# Altium project TLO Rock electronics.PrjPcb
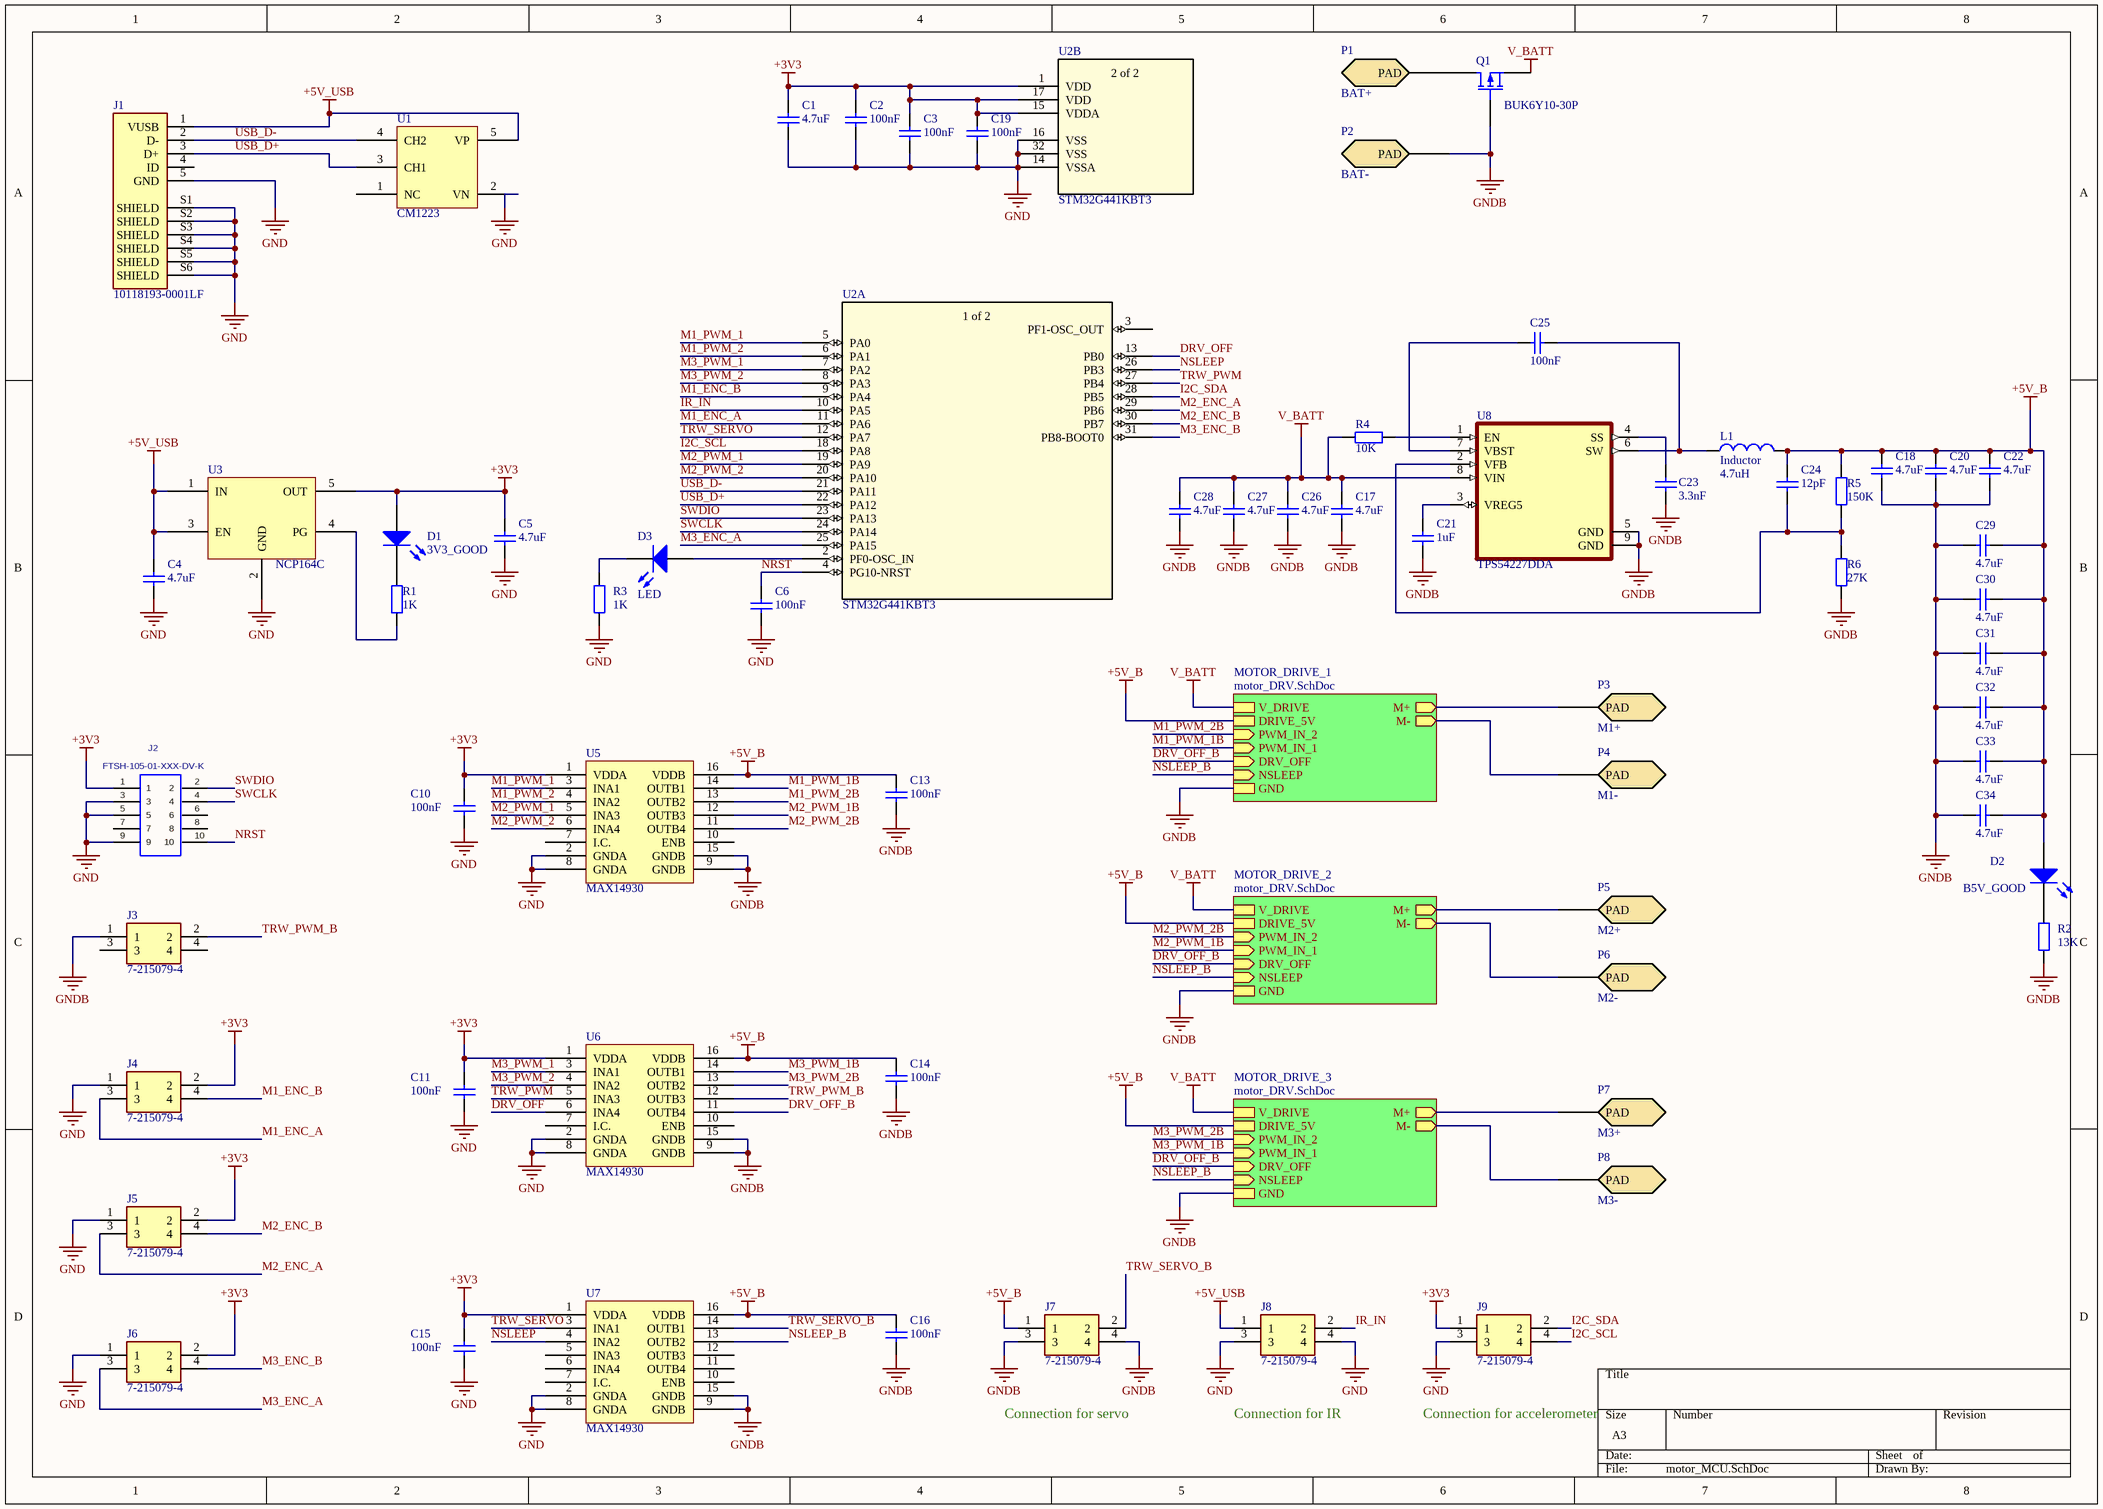
[diagram p0: motor_MCU.SchDoc]
2 sheets, 101 parts. Net scope: hierarchical (ports join the sheet entries above them; power ports are global).
Board file: PCB.PcbDoc
Sheets:
  motor_MCU.SchDoc
    MOTOR_DRIVE_1 = motor_DRV.SchDoc
    MOTOR_DRIVE_2 = motor_DRV.SchDoc
    MOTOR_DRIVE_3 = motor_DRV.SchDoc

## Sheet motor_MCU.SchDoc
size A3; SheetNumber: 1; SheetTotal: 2

### Parts
C1  value 4.7uF  [1608[0603]]  (hidden comment: Cap Semi)
C2  value 100nF  [1608[0603]]  (hidden comment: Cap Semi)
C3  value 100nF  [1608[0603]]  (hidden comment: Cap Semi)
C4  value 4.7uF  [1608[0603]]  (hidden comment: Cap Semi)
C5  value 4.7uF  [1608[0603]]  (hidden comment: Cap Semi)
C6  value 100nF  [1608[0603]]  (hidden comment: Cap Semi)
C10  value 100nF  [1608[0603]]  (hidden comment: Cap Semi)
C11  value 100nF  [1608[0603]]  (hidden comment: Cap Semi)
C13  value 100nF  [1608[0603]]  (hidden comment: Cap Semi)
C14  value 100nF  [1608[0603]]  (hidden comment: Cap Semi)
C15  value 100nF  [1608[0603]]  (hidden comment: Cap Semi)
C16  value 100nF  [1608[0603]]  (hidden comment: Cap Semi)
C17  value 4.7uF  [1608[0603]]  (hidden comment: Cap Semi)
C18  value 4.7uF  [1608[0603]]  (hidden comment: Cap Semi)
C19  value 100nF  [1608[0603]]  (hidden comment: Cap Semi)
C20  value 4.7uF  [1608[0603]]  (hidden comment: Cap Semi)
C21  value 1uF  [1608[0603]]  (hidden comment: Cap Semi)
C22  value 4.7uF  [1608[0603]]  (hidden comment: Cap Semi)
C23  value 3.3nF  [1608[0603]]  (hidden comment: Cap Semi)
C24  value 12pF  [1608[0603]]  (hidden comment: Cap Semi)
C25  value 100nF  [1608[0603]]  (hidden comment: Cap Semi)
C26  value 4.7uF  [1608[0603]]  (hidden comment: Cap Semi)
C27  value 4.7uF  [1608[0603]]  (hidden comment: Cap Semi)
C28  value 4.7uF  [1608[0603]]  (hidden comment: Cap Semi)
C29  value 4.7uF  [1608[0603]]  (hidden comment: Cap Semi)
C30  value 4.7uF  [1608[0603]]  (hidden comment: Cap Semi)
C31  value 4.7uF  [1608[0603]]  (hidden comment: Cap Semi)
C32  value 4.7uF  [1608[0603]]  (hidden comment: Cap Semi)
C33  value 4.7uF  [1608[0603]]  (hidden comment: Cap Semi)
C34  value 4.7uF  [1608[0603]]  (hidden comment: Cap Semi)
D1  3V3_GOOD  [1608[0603]]
D2  B5V_GOOD  [1608[0603]]
D3  LED  [1608[0603]]
J1  10118193-0001LF  [FCI_10118193-0001LF]
J2  FTSH-105-01-XXX-DV-K  [FTSH-105-01-XXX-DV-K]
J3  7-215079-4  [TE_7-215079-4]
J4  7-215079-4  [TE_7-215079-4]
J5  7-215079-4  [TE_7-215079-4]
J6  7-215079-4  [TE_7-215079-4]
J7  7-215079-4  [TE_7-215079-4]
J8  7-215079-4  [TE_7-215079-4]
J9  7-215079-4  [TE_7-215079-4]
L1  Inductor  value 4.7uH  [WE-PD-M-PB]
P1  BAT+  [PCBComponent_1]
P2  BAT-  [PCBComponent_1]
P3  M1+  [PCBComponent_1]
P4  M1-  [PCBComponent_1]
P5  M2+  [PCBComponent_1]
P6  M2-  [PCBComponent_1]
P7  M3+  [PCBComponent_1]
P8  M3-  [PCBComponent_1]
Q1  BUK6Y10-30P  [TO127P600X120-5N]
R1  value 1K  [J1-0603]  (hidden comment: Res2)
R2  value 13K  [J1-0603]  (hidden comment: Res2)
R3  value 1K  [J1-0603]  (hidden comment: Res2)
R4  value 10K  [J1-0603]  (hidden comment: Res2)
R5  value 150K  [J1-0603]  (hidden comment: Res2)
R6  value 27K  [J1-0603]  (hidden comment: Res2)
U1  CM1223  [SOT23-5]
U2  STM32G441KBT3  [LQFP32_7X7_STM]  (parts A,B of 2)
U3  NCP164C  [SOT23-5]
U5  MAX14930  [SOIC16_N]
U6  MAX14930  [SOIC16_N]
U7  MAX14930  [SOIC16_N]
U8  TPS54227DDA  [VREG_LM5017MR/NOPB]

### Sub-sheets
MOTOR_DRIVE_1 = motor_DRV.SchDoc: V_DRIVE, DRIVE_5V, PWM_IN_2 (in), PWM_IN_1 (in), DRV_OFF (in), GND, M+ (out), M- (out), NSLEEP (in)
MOTOR_DRIVE_2 = motor_DRV.SchDoc: V_DRIVE, DRIVE_5V, PWM_IN_2 (in), PWM_IN_1 (in), DRV_OFF (in), GND, M+ (out), M- (out), NSLEEP (in)
MOTOR_DRIVE_3 = motor_DRV.SchDoc: V_DRIVE, DRIVE_5V, PWM_IN_2 (in), PWM_IN_1 (in), DRV_OFF (in), GND, M+ (out), M- (out), NSLEEP (in)

### Nets
+3V3: C1.2 C2.2 C3.2 C5.2 C10.2 C11.2 C15.2 C19.2 D1.1(A) J2.1 J4.2 J5.2 J6.2 J9.1 U2.1(VDD) U2.15(VDDA) U2.17(VDD) U3.5(OUT) U5.1(VDDA) U6.1(VDDA) U7.1(VDDA)
+5V_B: C13.2 C14.2 C16.2 C18.2 C20.2 C22.2 C24.2 C29.1 C30.1 C31.1 C32.1 C33.1 C34.1 D2.1(A) J7.1 L1.2 R5.1 U5.16(VDDB) U6.16(VDDB) U7.16(VDDB) ; sheet MOTOR_DRIVE_1/DRIVE_5V, sheet MOTOR_DRIVE_2/DRIVE_5V, sheet MOTOR_DRIVE_3/DRIVE_5V
+5V_USB: C4.2 J1.1(VUSB) J8.1 U1.5(VP) U3.1(IN) U3.3(EN)
GND: C1.1 C2.1 C3.1 C4.1 C5.1 C6.1 C10.1 C11.1 C15.1 C19.1 J1.5(GND) J1.S1(SHIELD) J1.S2(SHIELD) J1.S3(SHIELD) J1.S4(SHIELD) J1.S5(SHIELD) J1.S6(SHIELD) J2.3 J2.5 J2.9 J4.1 J5.1 J6.1 J8.3 J8.4 J9.3 R3.1 U1.2(VN) U2.14(VSSA) U2.16(VSS) U2.32(VSS) U3.2(GND) U5.2(GNDA) U5.8(GNDA) U6.2(GNDA) U6.8(GNDA) U7.2(GNDA) U7.8(GNDA)
GNDB: C13.1 C14.1 C16.1 C17.1 C18.1 C20.1 C21.1 C22.1 C23.2 C26.1 C27.1 C28.1 C29.2 C30.2 C31.2 C32.2 C33.2 C34.2 J3.1 J7.3 J7.4 P2.1(PAD) Q1.4(G) R2.1 R6.2 U5.9(GNDB) U5.15(GNDB) U6.9(GNDB) U6.15(GNDB) U7.9(GNDB) U7.15(GNDB) U8.5(GND) U8.9(GND) ; sheet MOTOR_DRIVE_1/GND, sheet MOTOR_DRIVE_2/GND, sheet MOTOR_DRIVE_3/GND
V_BATT: C17.2 C26.2 C27.2 C28.2 Q1.1,2,3(S) R4.2 U8.8(VIN) ; sheet MOTOR_DRIVE_1/V_DRIVE, sheet MOTOR_DRIVE_2/V_DRIVE, sheet MOTOR_DRIVE_3/V_DRIVE
DRV_OFF: U2.13(PB0) U6.6(INA4)
DRV_OFF_B: U6.11(OUTB4) ; sheet MOTOR_DRIVE_1/DRV_OFF, sheet MOTOR_DRIVE_2/DRV_OFF, sheet MOTOR_DRIVE_3/DRV_OFF  [project net DRV_OFF]
I2C_SCL: J9.4 U2.18(PA8)
I2C_SDA: J9.2 U2.28(PB5)
IR_IN: J8.2 U2.10(PA5)
M1_ENC_A: J4.3 U2.11(PA6)
M1_ENC_B: J4.4 U2.9(PA4)
M1_PWM_1: U2.5(PA0) U5.3(INA1)
M1_PWM_1B: U5.14(OUTB1) ; sheet MOTOR_DRIVE_1/PWM_IN_1
M1_PWM_2: U2.6(PA1) U5.4(INA2)
M1_PWM_2B: U5.13(OUTB2) ; sheet MOTOR_DRIVE_1/PWM_IN_2
M2_ENC_A: J5.3 U2.29(PB6)
M2_ENC_B: J5.4 U2.30(PB7)
M2_PWM_1: U2.19(PA9) U5.5(INA3)
M2_PWM_1B: U5.12(OUTB3) ; sheet MOTOR_DRIVE_2/PWM_IN_1
M2_PWM_2: U2.20(PA10) U5.6(INA4)
M2_PWM_2B: U5.11(OUTB4) ; sheet MOTOR_DRIVE_2/PWM_IN_2
M3_ENC_A: J6.3 U2.25(PA15)
M3_ENC_B: J6.4 U2.31(PB8-BOOT0)
M3_PWM_1: U2.7(PA2) U6.3(INA1)
M3_PWM_1B: U6.14(OUTB1) ; sheet MOTOR_DRIVE_3/PWM_IN_1
M3_PWM_2: U2.8(PA3) U6.4(INA2)
M3_PWM_2B: U6.13(OUTB2) ; sheet MOTOR_DRIVE_3/PWM_IN_2
M_OUT_+: P3.1(PAD) ; sheet MOTOR_DRIVE_1/M+
M_OUT_+: P5.1(PAD) ; sheet MOTOR_DRIVE_2/M+  [a separate net that carries the same name]
M_OUT_+: P7.1(PAD) ; sheet MOTOR_DRIVE_3/M+  [a separate net that carries the same name]
M_OUT_-: P4.1(PAD) ; sheet MOTOR_DRIVE_1/M-
M_OUT_-: P6.1(PAD) ; sheet MOTOR_DRIVE_2/M-  [a separate net that carries the same name]
M_OUT_-: P8.1(PAD) ; sheet MOTOR_DRIVE_3/M-  [a separate net that carries the same name]
NRST: C6.2 J2.10 U2.4(PG10-NRST)
NSLEEP: U2.26(PB3) U7.4(INA2)
NSLEEP_B: U7.13(OUTB2) ; sheet MOTOR_DRIVE_1/NSLEEP, sheet MOTOR_DRIVE_2/NSLEEP, sheet MOTOR_DRIVE_3/NSLEEP  [project net nSLEEP]
SWCLK: J2.4 U2.24(PA14)
SWDIO: J2.2 U2.23(PA13)
TRW_PWM: U2.27(PB4) U6.5(INA3)
TRW_PWM_B: J3.2 U6.12(OUTB3)
TRW_SERVO: U2.12(PA7) U7.3(INA1)
TRW_SERVO_B: J7.2 U7.14(OUTB1)
USB_D+: J1.3(D+) U1.3(CH1) U2.22(PA12)
USB_D-: J1.2(D-) U1.4(CH2) U2.21(PA11)
NetC21_2: C21.2 U8.3(VREG5)
NetC23_1: C23.1 U8.4(SS)
NetC24_1: C24.1 R5.2 R6.1 U8.2(VFB)
NetC25_1: C25.1 L1.1 U8.6(SW)
NetC25_2: C25.2 U8.7(VBST)
NetD1_2: D1.2(K) R1.2
NetD2_2: D2.2(K) R2.2
NetD3_1: D3.1(A) U2.2(PF0-OSC_IN)
NetD3_2: D3.2(K) R3.2
NetP1_1: P1.1(PAD) Q1.5(D)
NetR1_1: R1.1 U3.4(PG)
NetR4_1: R4.1 U8.1(EN)

Not connected (* = marked no-connect by the designer): J1 4(ID); J2 6 7 8; J3 3 4; U1 1(NC); U2 3(PF1-OSC_OUT); U5 7(I.C.) 10(ENB); U6 7(I.C.) 10(ENB); U7 5(INA3) 6(INA4) 7(I.C.) 10(ENB) 11(OUTB4) 12(OUTB3)

### Notes on the sheet
- Connection for servo
- Connection for IR
- Connection for accelerometer
- (in symbol STM32G441KBT3, part A) 1 of 2
- (in symbol STM32G441KBT3, part B) 2 of 2

### Library data of the parts
C1-C6 C10 C11 C13-C34 = Cap Semi: Capacitor (Semiconductor SIM Model); Published: 8-Jun-2000; LatestRevisionDate: 29-May-2009; LatestRevisionNote: IPC-7351 Footprint Added.; PackageReference: C1206; Publisher: Altium Limited; PackageDescription: Chip Capacitor
D1-D3 = LED2: Typical RED, GREEN, YELLOW, AMBER GaAs LED; Published: 8-Jun-2000; LatestRevisionDate: 17-Jul-2002; LatestRevisionNote: Re-released for DXP Platform.; PackageVersion: Feb-2002; PackageReference: 3.2X1.6X1.1; Publisher: Altium Limited; PackageDescription: SM LED; 2 Flat Leads
J1 = 10118193-0001LF: USB - micro B USB 2.0 Receptacle Connector 5 Position Surface Mount, Right Angle; Through Hole; MF: Amphenol ICC; Availability: Unavailable; SnapEDA_Link: https://www.snapeda.com/parts/10118193-0001LF/Amphenol%20FCI/view-part/2758989/?ref=snap; MP: 10118193-0001LF; Price: None; Value: *; Package: None
J2 = FTSH-105-01-XXX-DV-K: TERMINAL STRIP, .050"(1.27mm) PITCH, 10 PINS, KEYED; MANUFACTURER: SAMTEC; CREATED: November 30, 2016 - Wendy Xin; PCB DECAL: FTSH-105-01-XXX-DV-K
J3-J9 = 7-215079-4: Micro-MaTch 4 Position 1.27 mm Pitch Vertical Female-on-Board Connector; MF: TE Connectivity; MP: 7-215079-4; Value: *; SnapEDA_Link: https://www.snapeda.com/parts/7-215079-4/TE%20Connectivity%20AMP%20Connectors/view-part/453401/?ref=snap; Price: None; Package: SMD-6; Availability: Unavailable
L1 = Inductor: Code_IEC: 1005; Published: 8-Jun-2000; LatestRevisionDate: 29-May-2009; LatestRevisionNote: IPC-7351 Footprint Added.; PackageReference: 0402-A; Publisher: Altium Limited; PackageDescription: Chip Inductor; Code_JEITA: 0402
P1-P8 = Component_1
Q1 = MOSFET-P: P-Channel MOSFET; Published: 8-Jun-2000; LatestRevisionDate: 17-Jul-2002; LatestRevisionNote: Re-released for DXP Platform.; PackageVersion: 1995/1996; PackageReference: E3; Publisher: Altium Limited; PackageDescription: TO, Flat Index; 3 In-Line, Axial Leads; Body Dia. 4.6mm; Lead Dia. 0.5 mm (max)
R1-R6 = Res2: Resistor; Published: 8-Jun-2000; LatestRevisionDate: 17-Jul-2002; LatestRevisionNote: Re-released for DXP Platform.; PackageReference: AXIAL-0.4; Publisher: Altium Limited; PackageDescription: Axial Device, Thru-Hole; 2 Leads; 0.4 in Pin Spacing
U2 = STM32G441KBT3: No Description Available; SourceLibrary: Add_to_database_2020-11-05; Built_By: EMA_Cory; Vendor: STMicroelectronics; Datasheet: https://www.st.com/resource/en/datasheet/stm32g441kb.pdf; Copyright: Copyright (C) 2018 Accelerated Designs. All rights reserved; Manufacturer_Part_Number: STM32G441KBT3; RefDes: RefDes; Type: DEV
U8 = TPS54227DDA: Package: None; Price: None; Value: *; MP: TPS54227DDA; Availability: Unavailable

## Sheet motor_DRV.SchDoc
size A4; SheetNumber: 2; SheetTotal: 2
Used 3 times, as channels MOTOR_DRIVE_1, MOTOR_DRIVE_2, MOTOR_DRIVE_3. Parts and nets are listed once, with the designators drawn on the sheet.
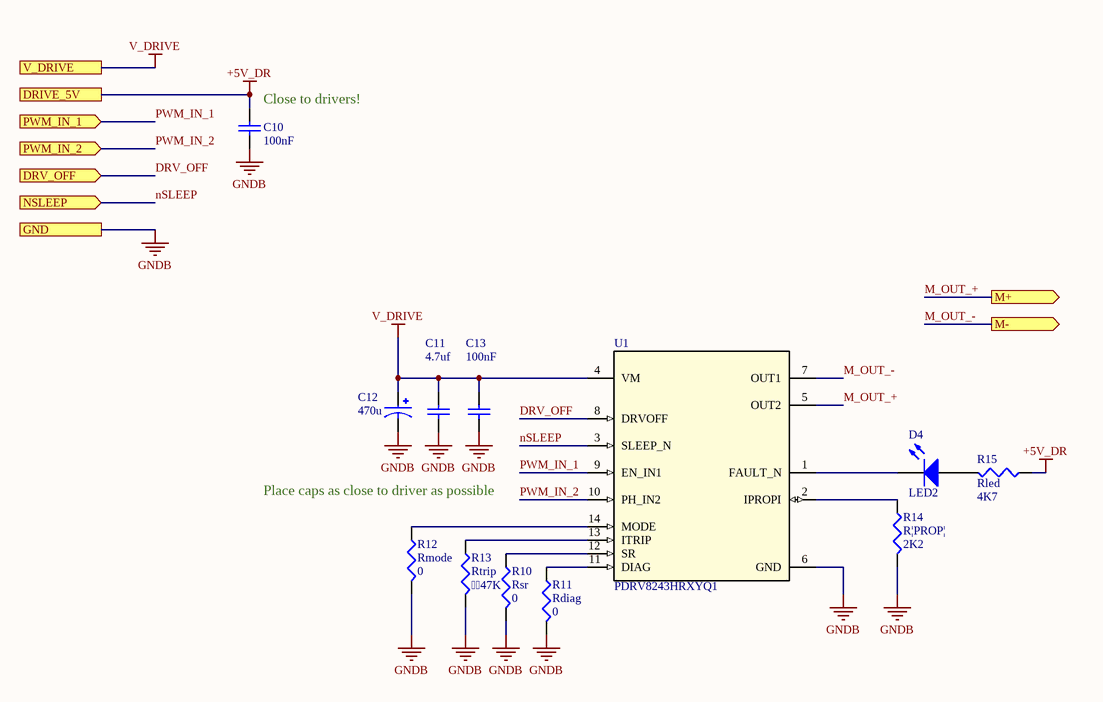
[diagram p1: motor_DRV.SchDoc]

### Parts
C10  value 100nF  [1608[0603]]  (hidden comment: Cap Semi)
C11  value 4.7uf  [1608[0603]]  (hidden comment: Cap Semi)
C12  470u  [CAPPRD500W60D800H1500]
C13  value 100nF  [1608[0603]]  (hidden comment: Cap Semi)
D4  LED2  [1608[0603]]
R10  Rsr  value 0  [J1-0603]
R11  Rdiag  value 0  [J1-0603]
R12  Rmode  value 0  [J1-0603]
R13  Rtrip  value 47K  [J1-0603]
R14  R|PROP|  value 2K2  [J1-0603]
R15  Rled  value 4K7  [J1-0603]
U1  PDRV8243HRXYQ1  [RXY0014A-MFG]

### Ports
DRIVE_5V, DRV_OFF (in), GND, M+ (out), M- (out), NSLEEP (in), PWM_IN_1 (in), PWM_IN_2 (in), V_DRIVE

### Nets
+5V_DR: C10.2 R15.2 ; port DRIVE_5V
GNDB: C10.1 C11.1 C12.N C13.1 R10.2 R11.2 R12.2 R13.2 R14.2 U1.6(GND) ; port GND
V_DRIVE: C11.2 C12.P C13.2 U1.4(VM) ; port V_DRIVE
DRV_OFF: U1.8(DRVOFF) ; port DRV_OFF
M_OUT_+: U1.5(OUT2) ; port M+
M_OUT_-: U1.7(OUT1) ; port M-
nSLEEP: U1.3(SLEEP_N) ; port NSLEEP
PWM_IN_1: U1.9(EN_IN1) ; port PWM_IN_1
PWM_IN_2: U1.10(PH_IN2) ; port PWM_IN_2
NetD4_1: D4.1(A) R15.1
NetD4_2: D4.2(K) U1.1(FAULT_N)
NetR10_1: R10.1 U1.12(SR)
NetR11_1: R11.1 U1.11(DIAG)
NetR12_1: R12.1 U1.14(MODE)
NetR13_1: R13.1 U1.13(ITRIP)
NetR14_1: R14.1 U1.2(IPROPI)

### Channels
MOTOR_DRIVE_1: designators end in _MOTOR_DRIVE_1; ports DRIVE_5V=+5V_B DRV_OFF=DRV_OFF GND=GNDB M+=M_OUT_+ M-=M_OUT_- NSLEEP=nSLEEP PWM_IN_1=M1_PWM_1B PWM_IN_2=M1_PWM_2B V_DRIVE=V_BATT
MOTOR_DRIVE_2: designators end in _MOTOR_DRIVE_2; ports DRIVE_5V=+5V_B DRV_OFF=DRV_OFF GND=GNDB M+=M_OUT_+ M-=M_OUT_- NSLEEP=nSLEEP PWM_IN_1=M2_PWM_1B PWM_IN_2=M2_PWM_2B V_DRIVE=V_BATT
MOTOR_DRIVE_3: designators end in _MOTOR_DRIVE_3; ports DRIVE_5V=+5V_B DRV_OFF=DRV_OFF GND=GNDB M+=M_OUT_+ M-=M_OUT_- NSLEEP=nSLEEP PWM_IN_1=M3_PWM_1B PWM_IN_2=M3_PWM_2B V_DRIVE=V_BATT

### Notes on the sheet
- (near C10) Close to drivers!
- Place caps as close to driver as possible

### Library data of the parts
C10 C11 C13 = Cap Semi: Capacitor (Semiconductor SIM Model); Published: 8-Jun-2000; LatestRevisionDate: 29-May-2009; LatestRevisionNote: IPC-7351 Footprint Added.; PackageReference: C1206; Publisher: Altium Limited; PackageDescription: Chip Capacitor
C12 = EEUFR1E471YB: 470F 25V Aluminum Electrolytic Capacitors Radial, Can 8000 Hrs @ 105C; MF: Panasonic; Value: *; Price: None; Availability: In Stock; SnapEDA_Link: https://www.snapeda.com/parts/EEUFR1E471YB/Panasonic/view-part/5797024/?ref=snap; Check_prices: https://www.snapeda.com/parts/EEUFR1E471YB/Panasonic/view-part/5797024/?ref=eda; Package: RADIAL-2 Panasonic; MP: EEUFR1E471YB
D4 = LED2: as D1 on sheet motor_MCU; Published: 8-Jun-2000; LatestRevisionDate: 17-Jul-2002; LatestRevisionNote: Re-released for DXP Platform.; PackageVersion: Feb-2002; PackageReference: 3.2X1.6X1.1; Publisher: Altium Limited; PackageDescription: SM LED; 2 Flat Leads
R10-R15 = Res3: Resistor; Published: 8-Jun-2000; LatestRevisionDate: 29-May-2009; LatestRevisionNote: IPC-7351 Footprint Added.; PackageReference: J1-0603; Publisher: Altium Limited; PackageDescription: Chip Resistor
U1 = PDRV8243HRXYQ1: No Description Available; Mfr_Name: Texas Instruments; Type: DEV; RefDes: RefDes; Copyright: Copyright (C) 2021 Ultra Librarian. All rights reserved.; Manufacturer_Part_Number: PDRV8243HRXYQ1

## Nets that join several sheets
+5V_B: motor_MCU (20 pins), MOTOR_DRIVE_1 (C10_MOTOR_DRIVE_1.2 R15_MOTOR_DRIVE_1.2), MOTOR_DRIVE_2 (C10_MOTOR_DRIVE_2.2 R15_MOTOR_DRIVE_2.2), MOTOR_DRIVE_3 (C10_MOTOR_DRIVE_3.2 R15_MOTOR_DRIVE_3.2)
GNDB: motor_MCU (33 pins), MOTOR_DRIVE_1 (10 pins), MOTOR_DRIVE_2 (10 pins), MOTOR_DRIVE_3 (10 pins)
V_BATT: motor_MCU (7 pins), MOTOR_DRIVE_1 (C11_MOTOR_DRIVE_1.2 C12_MOTOR_DRIVE_1.P C13_MOTOR_DRIVE_1.2 U1_MOTOR_DRIVE_1.4), MOTOR_DRIVE_2 (C11_MOTOR_DRIVE_2.2 C12_MOTOR_DRIVE_2.P C13_MOTOR_DRIVE_2.2 U1_MOTOR_DRIVE_2.4), MOTOR_DRIVE_3 (C11_MOTOR_DRIVE_3.2 C12_MOTOR_DRIVE_3.P C13_MOTOR_DRIVE_3.2 U1_MOTOR_DRIVE_3.4)
DRV_OFF: motor_MCU (U6.11), MOTOR_DRIVE_1 (U1_MOTOR_DRIVE_1.8), MOTOR_DRIVE_2 (U1_MOTOR_DRIVE_2.8), MOTOR_DRIVE_3 (U1_MOTOR_DRIVE_3.8)
M1_PWM_1B: motor_MCU (U5.14), MOTOR_DRIVE_1 (U1_MOTOR_DRIVE_1.9)
M1_PWM_2B: motor_MCU (U5.13), MOTOR_DRIVE_1 (U1_MOTOR_DRIVE_1.10)
M2_PWM_1B: motor_MCU (U5.12), MOTOR_DRIVE_2 (U1_MOTOR_DRIVE_2.9)
M2_PWM_2B: motor_MCU (U5.11), MOTOR_DRIVE_2 (U1_MOTOR_DRIVE_2.10)
M3_PWM_1B: motor_MCU (U6.14), MOTOR_DRIVE_3 (U1_MOTOR_DRIVE_3.9)
M3_PWM_2B: motor_MCU (U6.13), MOTOR_DRIVE_3 (U1_MOTOR_DRIVE_3.10)
M_OUT_+: motor_MCU (P3.1), MOTOR_DRIVE_1 (U1_MOTOR_DRIVE_1.5)
M_OUT_+: motor_MCU (P5.1), MOTOR_DRIVE_2 (U1_MOTOR_DRIVE_2.5)
M_OUT_+: motor_MCU (P7.1), MOTOR_DRIVE_3 (U1_MOTOR_DRIVE_3.5)
M_OUT_-: motor_MCU (P4.1), MOTOR_DRIVE_1 (U1_MOTOR_DRIVE_1.7)
M_OUT_-: motor_MCU (P6.1), MOTOR_DRIVE_2 (U1_MOTOR_DRIVE_2.7)
M_OUT_-: motor_MCU (P8.1), MOTOR_DRIVE_3 (U1_MOTOR_DRIVE_3.7)
nSLEEP: motor_MCU (U7.13), MOTOR_DRIVE_1 (U1_MOTOR_DRIVE_1.3), MOTOR_DRIVE_2 (U1_MOTOR_DRIVE_2.3), MOTOR_DRIVE_3 (U1_MOTOR_DRIVE_3.3)